# Altium schematic sheet 12V_Regulators.SchDoc
size A
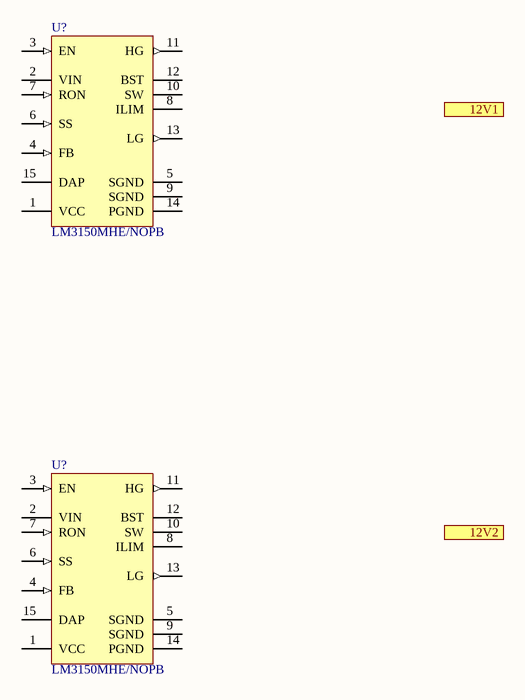
[diagram p0: 12V_Regulators.SchDoc]

## Parts
(Parts that share a designator on the sheet are numbered #1, #2 ... from top to bottom, then left to right.)
U?#1  LM3150MHE/NOPB  [PWP0014A_L]
U?#2  LM3150MHE/NOPB  [PWP0014A_L]

## Ports
12V1 (out), 12V2 (out)

## Nets

Not connected (* = marked no-connect by the designer): U?#1 1(VCC) 2(VIN) 3(EN) 4(FB) 5(SGND) 6(SS) 7(RON) 8(ILIM) 9(SGND) 10(SW) 11(HG) 12(BST) 13(LG) 14(PGND) 15(DAP); U?#2 1(VCC) 2(VIN) 3(EN) 4(FB) 5(SGND) 6(SS) 7(RON) 8(ILIM) 9(SGND) 10(SW) 11(HG) 12(BST) 13(LG) 14(PGND) 15(DAP)

## Library data of the parts
U?#1 U?#2 = CMP-0069-01799-3: SIMPLE SWITCHER® CONTROLLER, 42V Synchronous Step-Down, 14-pin TSSOP-EP, Pb-Free; Manufacturer: Texas Instruments; PackageTopMarking: NSUZXYTT*LM3150*MH; PowerWise: Y; ComponentLink1URL: http://www.ti.com/general/docs/lit/getliterature.tsp?genericPartNumber=LM3150&fileType=pdf; PinCount: 14; RoHS: Y; PackageDescription: Molded TSSOP, JEDEC, Exposed Pad, 5.0 x 4.4 x 0.9mm Body, 14 Lead, 0.65mm Pitch; ComponentLink1Description: Datasheet URL; CompType: Switcher; PackageReference: PWP0014A; Code_JEDEC: MO-153-ABT-1